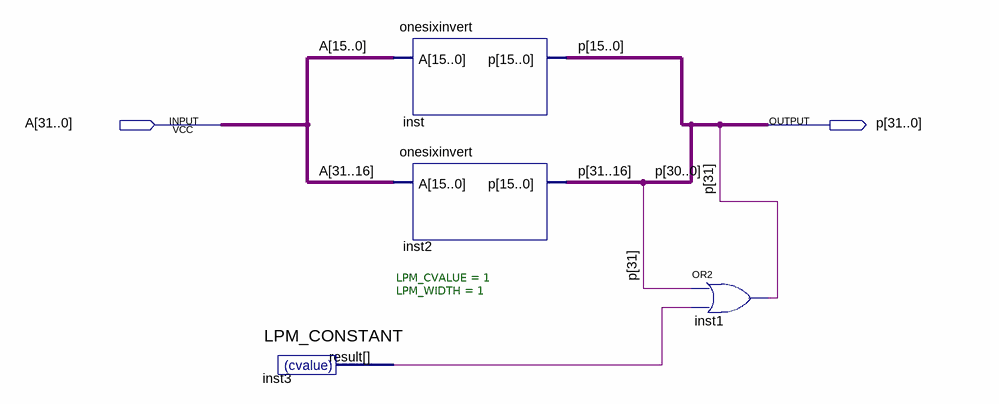
[diagram p0: schematic sheet]
// Quartus schematic threetwoinverter.bdf as structural Verilog: 4 symbols, 2 pins
module threetwoinverter (
  input  [31:0] A,
  output [31:0] p
);

  wire inst3_result;

  LPM_CONSTANT #(.LPM_CVALUE(1), .LPM_WIDTH(1)) inst3 (.result(inst3_result));
  onesixinvert inst (.A(A[15:0]), .p(p[15:0]));
  onesixinvert inst2 (.A(A[31:16]), .p(p[31:16]));
  or inst1 (p[31], p[31], inst3_result);
endmodule
